# EAGLE board XMICRO-PROTO (EAGLE 6.3), part 1 of 4
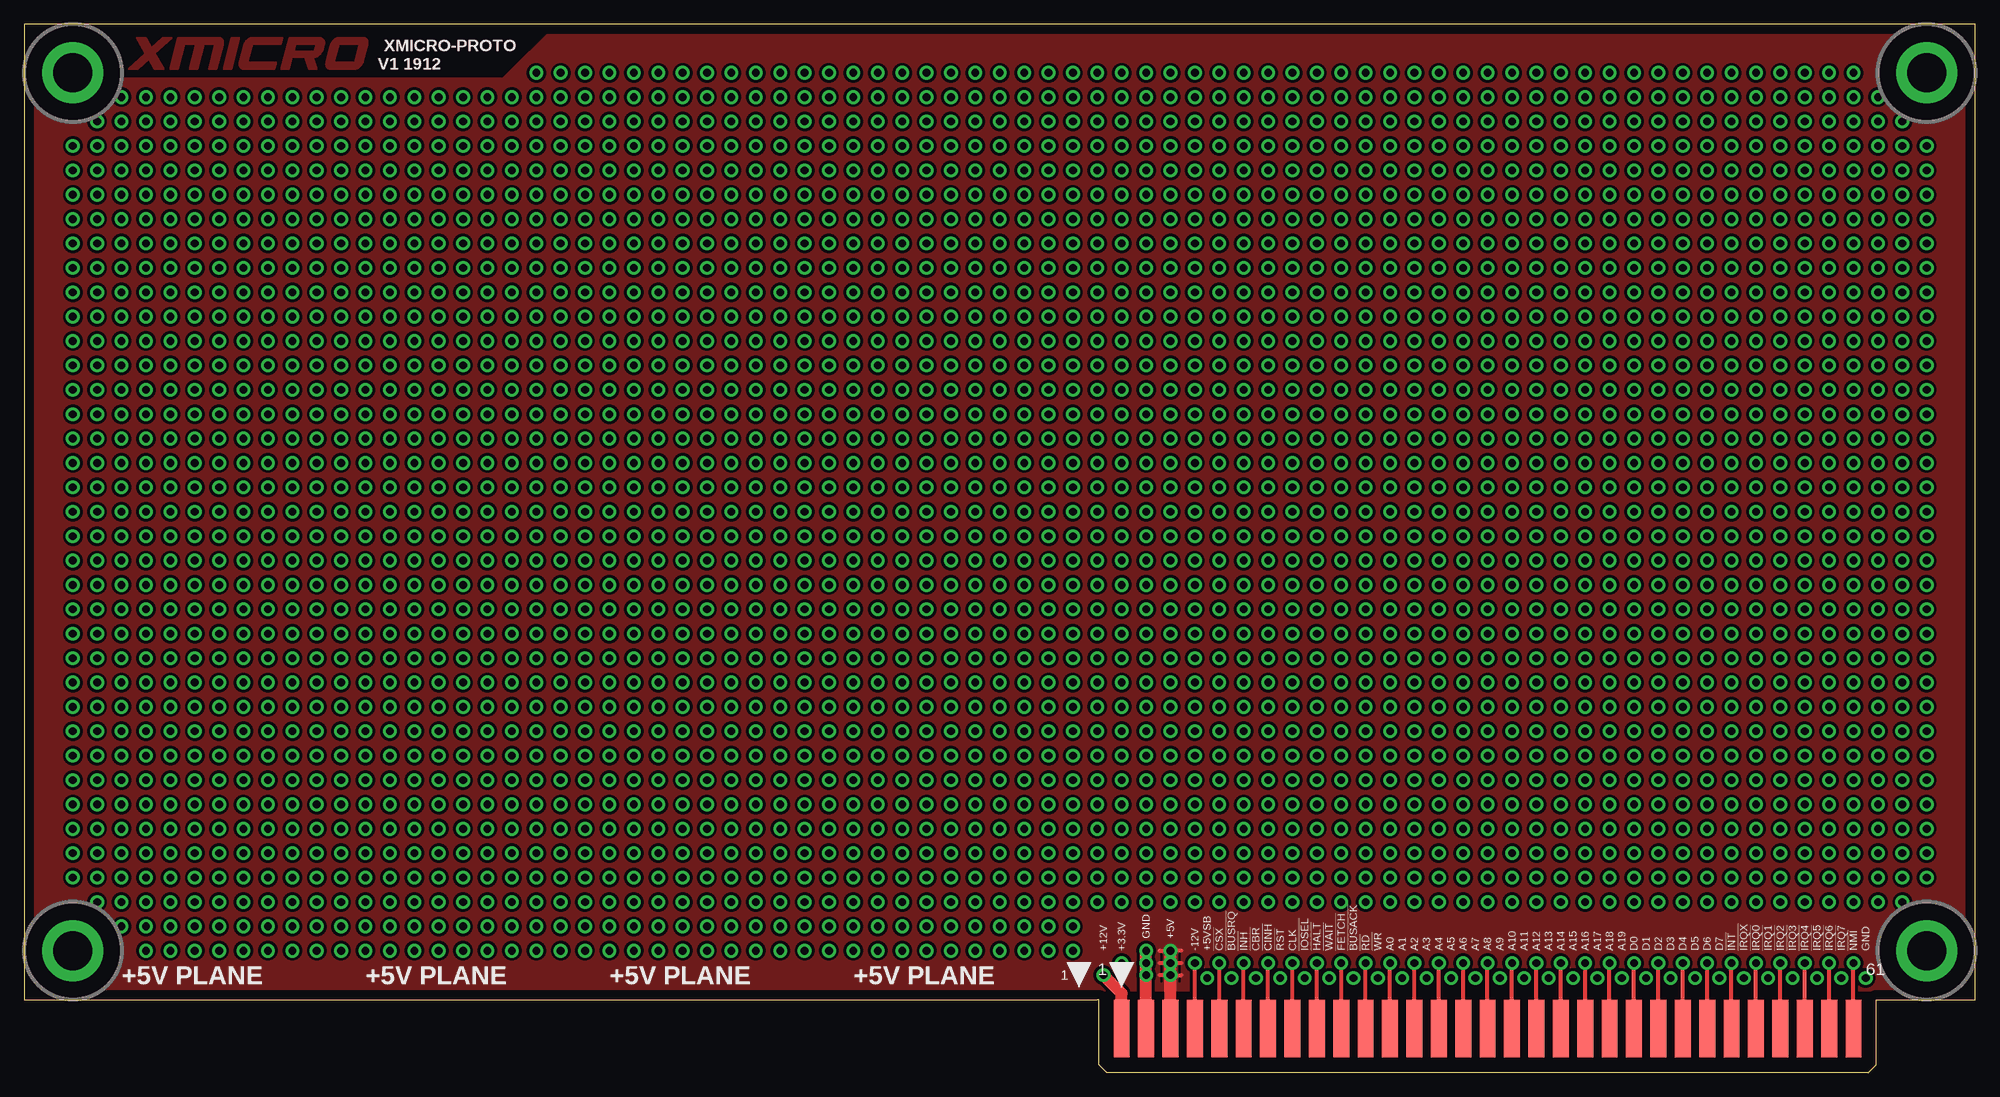
[diagram p1: board, top side]
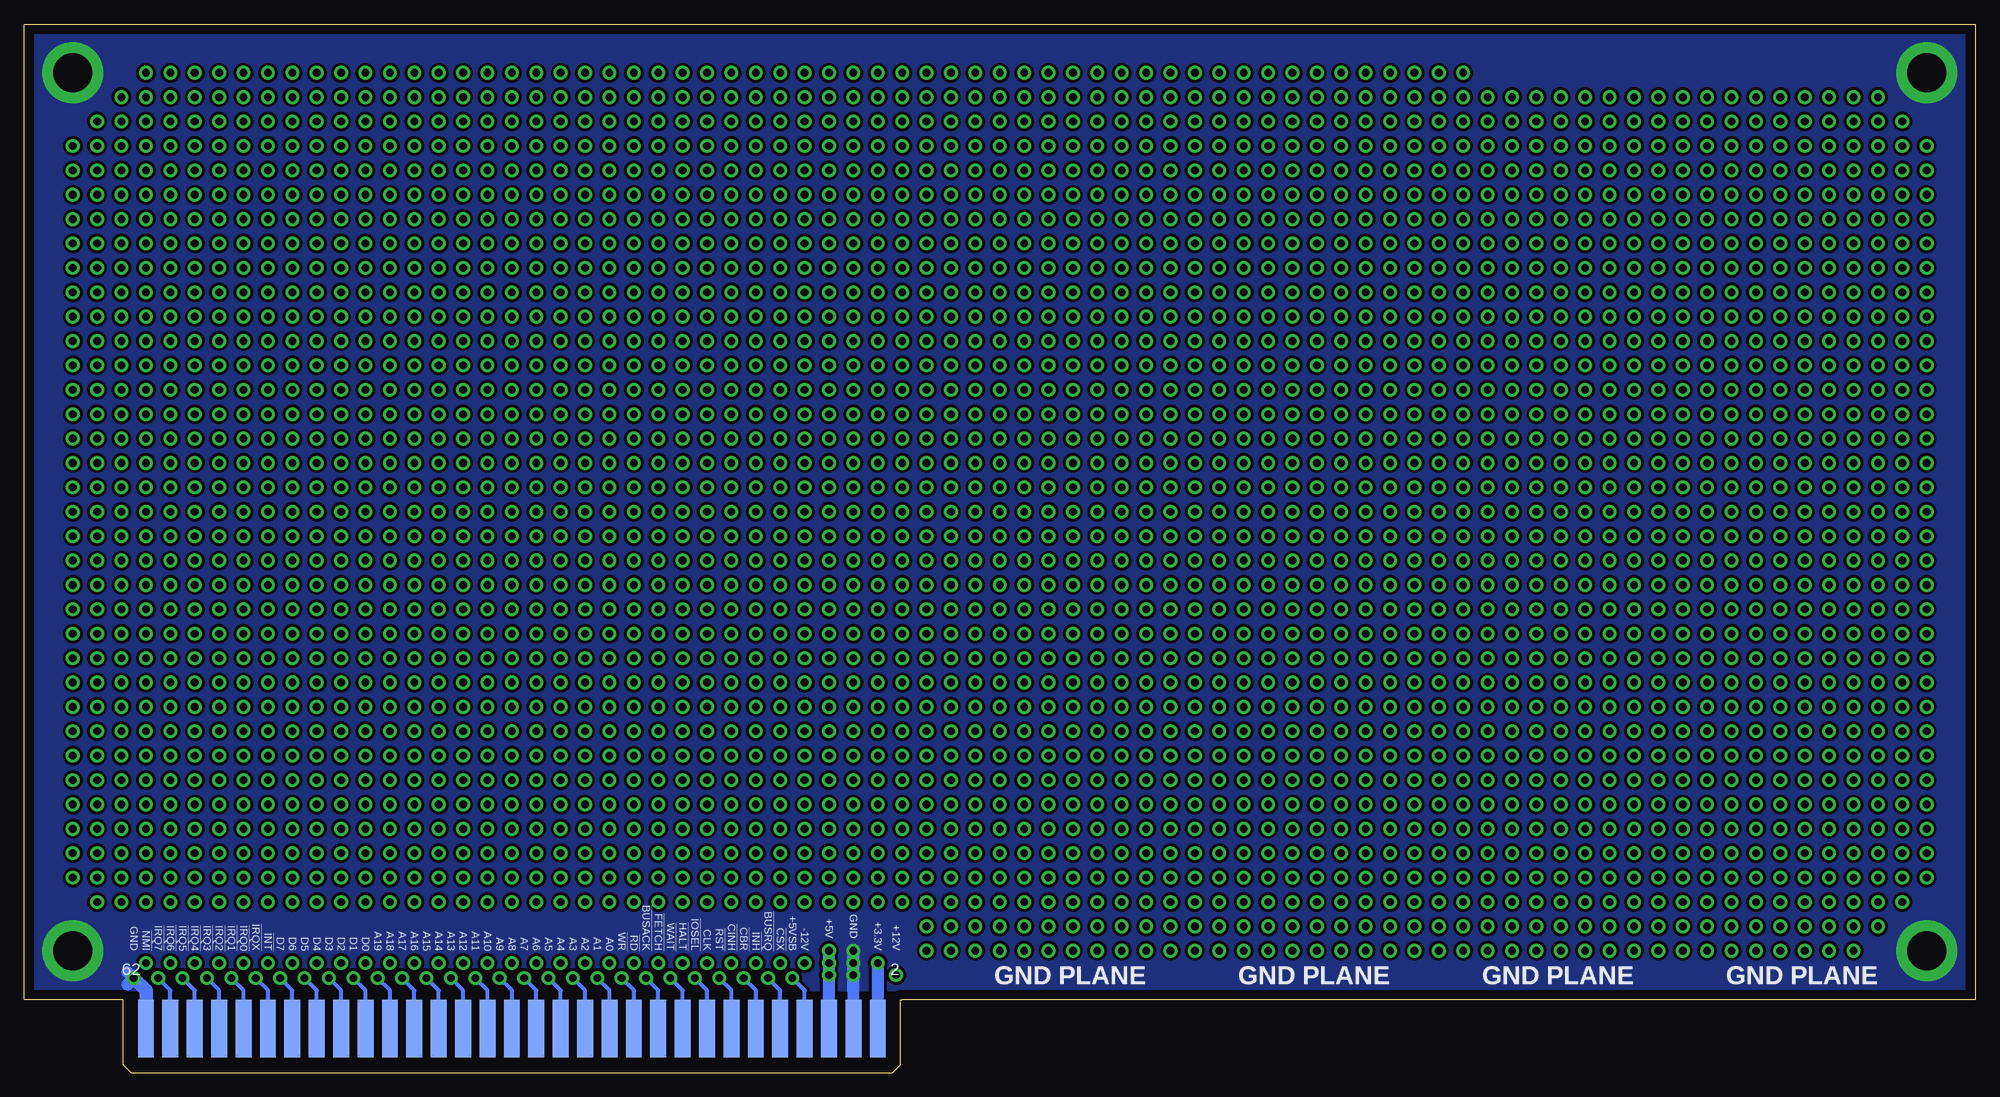
[diagram p2: board, bottom side, seen from below]

Size 203.2 x 109.22 mm. Coordinates in mm from the lower left corner, seen from the top.
Outline: 111.76,7.62 0,7.62 0,109.22 203.2,109.22 203.2,7.62 193.04,7.62
Copper layers (1*16): Top 0.035mm / dielectric 1.5mm / Bottom 0.035mm
Design rules "default *": minimum track width 10mil, minimum drill 0.3mm, track to track 12mil, track to pad 12mil, pad to pad 12mil, via to via 12mil, smd to smd 12mil, copper to edge 40mil, drill to drill 10mil, minimum pad ring 10mil, minimum via ring 8mil, stop-mask expansion 4mil, vias tented up to drill 100mil, thermal gap 12mil
Net classes: 0 default: width 0.254 mm, clearance 0.305 mm; 1 GND: width 0.254 mm, clearance 0.305 mm to class 0, clearance 0.305 mm; 2 +5V: width 0.254 mm, clearance 0.305 mm to class 0, clearance 0.381 mm to class 1, clearance 0.305 mm
tRestrict: area 0,7.6 to 10.2,17.8; area 0,99.1 to 10.2,109.2; area 193,99.1 to 203.2,109.2; area 193,7.6 to 203.2,17.8; 2 lines
bRestrict: area 188.6,8.3 to 191.1,10.8

## Footprints (pad centres in the part's own frame; a part is rotated, then mirrored left to right if it is on the bottom)
EDGE62M = smd 1.651 x 5.969: 1 -38.1,-3.01; 3 -35.56,-3.01; 5 -33.02,-3.01; 7 -30.48,-3.01; 9 -27.94,-3.01; 11 -25.4,-3.01; 13 -22.86,-3.01; 15 -20.32,-3.01; 17 -17.78,-3.01; 19 -15.24,-3.01; 21 -12.7,-3.01; 23 -10.16,-3.01; 25 -7.62,-3.01; 27 -5.08,-3.01; 29 -2.54,-3.01; 31 0,-3.01; 33 2.54,-3.01; 35 5.08,-3.01; 37 7.62,-3.01; 39 10.16,-3.01; 41 12.7,-3.01; 43 15.24,-3.01; 45 17.78,-3.01; 47 20.32,-3.01; 49 22.86,-3.01; 51 25.4,-3.01; 53 27.94,-3.01; 55 30.48,-3.01; 57 33.02,-3.01; 59 35.56,-3.01; 61 38.1,-3.01 | smd 1.651 x 5.969 bottom: 2 -38.1,-3.01; 4 -35.56,-3.01; 6 -33.02,-3.01; 8 -30.48,-3.01; 10 -27.94,-3.01; 12 -25.4,-3.01; 14 -22.86,-3.01; 16 -20.32,-3.01; 18 -17.78,-3.01; 20 -15.24,-3.01; 22 -12.7,-3.01; 24 -10.16,-3.01; 26 -7.62,-3.01; 28 -5.08,-3.01; 30 -2.54,-3.01; 32 0,-3.01; 34 2.54,-3.01; 36 5.08,-3.01; 38 7.62,-3.01; 40 10.16,-3.01; 42 12.7,-3.01; 44 15.24,-3.01; 46 17.78,-3.01; 48 20.32,-3.01; 50 22.86,-3.01; 52 25.4,-3.01; 54 27.94,-3.01; 56 30.48,-3.01; 58 33.02,-3.01; 60 35.56,-3.01; 62 38.1,-3.01

## Placement (x,y rotation side)
PC0  XMICRO-BUS-EDGE62M  [EDGE62M]  152.4,7.62 0 top

## Tracks (layer width: path | path; a pad name or v marks a point on that pad's centre or on a via)
!BUSACK  (via drill 0.8 pad 1.42)
  Bottom 0.406: PC0.20 137.16,8.57 v138.43,9.84
!BUSRQ  (via drill 0.8 pad 1.42)
  Bottom 0.406: PC0.10 124.46,8.57 v125.73,9.84
!CBR  (via drill 0.8 pad 1.42)
  Bottom 0.406: PC0.12 127,8.57 v128.27,9.84
!CINH  (via drill 0.8 pad 1.42)
  Top 0.406: PC0.13 v129.54,11.43
!CSX  (via drill 0.8 pad 1.42)
  Top 0.406: PC0.9 v124.46,11.43
!FETCH  (via drill 0.8 pad 1.42)
  Top 0.406: PC0.19 v137.16,11.43
!HALT  (via drill 0.8 pad 1.42)
  Top 0.406: PC0.17 v134.62,11.43
!INH  (via drill 0.8 pad 1.42)
  Top 0.406: PC0.11 v127,11.43
!INT  (via drill 0.8 pad 1.42)
  Top 0.406: PC0.51 v177.8,11.43
!IOSEL  (via drill 0.8 pad 1.42)
  Bottom 0.406: PC0.16 132.08,8.57 v133.35,9.84
!IRQ0  (via drill 0.8 pad 1.42)
  Top 0.406: PC0.53 v180.34,11.43
!IRQ1  (via drill 0.8 pad 1.42)
  Bottom 0.406: PC0.54 180.34,8.57 v181.61,9.84
!IRQ2  (via drill 0.8 pad 1.42)
  Top 0.406: PC0.55 v182.88,11.43
!IRQ3  (via drill 0.8 pad 1.42)
  Bottom 0.406: PC0.56 182.88,8.57 v184.15,9.84
!IRQ4  (via drill 0.8 pad 1.42)
  Top 0.406: PC0.57 v185.42,11.43
!IRQ5  (via drill 0.8 pad 1.42)
  Bottom 0.406: PC0.58 185.42,8.57 v186.69,9.84
!IRQ6  (via drill 0.8 pad 1.42)
  Top 0.406: PC0.59 v187.96,11.43
!IRQ7  (via drill 0.8 pad 1.42)
  Bottom 0.406: PC0.60 187.96,8.57 v189.23,9.84
!IRQX  (via drill 0.8 pad 1.42)
  Bottom 0.406: PC0.52 177.8,8.57 v179.07,9.84
!NMI  (via drill 0.8 pad 1.42)
  Top 0.406: PC0.61 v190.5,11.43
!RD  (via drill 0.8 pad 1.42)
  Top 0.406: PC0.21 v139.7,11.43
!RST  (via drill 0.8 pad 1.42)
  Bottom 0.406: PC0.14 129.54,8.57 v130.81,9.84
!WAIT  (via drill 0.8 pad 1.42)
  Bottom 0.406: PC0.18 134.62,8.57 v135.89,9.84
!WR  (via drill 0.8 pad 1.42)
  Bottom 0.406: PC0.22 139.7,8.57 v140.97,9.84
+3.3V  (via drill 0.8 pad 1.42)
  Bottom 1.27: PC0.2 v114.3,11.43
+5V  (via drill 0.8 pad 1.42)
  Top 0.406: 120.49,11.43 v119.38,11.43 118.27,11.43 | 118.27,12.7 v119.38,12.7 120.49,12.7 | 120.49,10.16 v119.38,10.16 118.27,10.16
  Top 1.27: PC0.6 v119.38,10.16 v119.38,11.43 v119.38,12.7
  Bottom 1.27: PC0.6 v119.38,10.16 v119.38,11.43 v119.38,12.7
  pour Top: 0,109.22 9.65,109.22 9.65,103.51 49.85,103.51 55.56,109.22 203.2,109.22 203.2,7.62 192.72,7.62 192.72,8.57 112.08,8.57 112.08,7.62 0,7.62
+5VSB  (via drill 0.8 pad 1.42)
  Bottom 0.406: PC0.8 121.92,8.57 v123.19,9.84
+12V  (via drill 0.8 pad 1.42)
  Top 1.27: PC0.1 114.3,8.26 v112.39,10.16
-12V  (via drill 0.8 pad 1.42)
  Top 0.406: PC0.7 v121.92,11.43
A0  (via drill 0.8 pad 1.42)
  Top 0.406: PC0.23 v142.24,11.43
A1  (via drill 0.8 pad 1.42)
  Bottom 0.406: PC0.24 142.24,8.57 v143.51,9.84
A2  (via drill 0.8 pad 1.42)
  Top 0.406: PC0.25 v144.78,11.43
A3  (via drill 0.8 pad 1.42)
  Bottom 0.406: PC0.26 144.78,8.57 v146.05,9.84
A4  (via drill 0.8 pad 1.42)
  Top 0.406: PC0.27 v147.32,11.43
A5  (via drill 0.8 pad 1.42)
  Bottom 0.406: PC0.28 147.32,8.57 v148.59,9.84
A6  (via drill 0.8 pad 1.42)
  Top 0.406: PC0.29 v149.86,11.43
A7  (via drill 0.8 pad 1.42)
  Bottom 0.406: PC0.30 149.86,8.57 v151.13,9.84
A8  (via drill 0.8 pad 1.42)
  Top 0.406: PC0.31 v152.4,11.43
A9  (via drill 0.8 pad 1.42)
  Bottom 0.406: PC0.32 152.4,8.57 v153.67,9.84
A10  (via drill 0.8 pad 1.42)
  Top 0.406: PC0.33 v154.94,11.43
A11  (via drill 0.8 pad 1.42)
  Bottom 0.406: PC0.34 154.94,8.57 v156.21,9.84
A12  (via drill 0.8 pad 1.42)
  Top 0.406: PC0.35 v157.48,11.43
A13  (via drill 0.8 pad 1.42)
  Bottom 0.406: PC0.36 157.48,8.57 v158.75,9.84
A14  (via drill 0.8 pad 1.42)
  Top 0.406: PC0.37 v160.02,11.43
A15  (via drill 0.8 pad 1.42)
  Bottom 0.406: PC0.38 160.02,8.57 v161.29,9.84
A16  (via drill 0.8 pad 1.42)
  Top 0.406: PC0.39 v162.56,11.43
A17  (via drill 0.8 pad 1.42)
  Bottom 0.406: PC0.40 162.56,8.57 v163.83,9.84
A18  (via drill 0.8 pad 1.42)
  Top 0.406: PC0.41 v165.1,11.43
A19  (via drill 0.8 pad 1.42)
  Bottom 0.406: PC0.42 165.1,8.57 v166.37,9.84
CLK  (via drill 0.8 pad 1.42)
  Top 0.406: PC0.15 v132.08,11.43
D0  (via drill 0.8 pad 1.42)
  Top 0.406: PC0.43 v167.64,11.43
D1  (via drill 0.8 pad 1.42)
  Bottom 0.406: PC0.44 167.64,8.57 v168.91,9.84
D2  (via drill 0.8 pad 1.42)
  Top 0.406: PC0.45 v170.18,11.43
D3  (via drill 0.8 pad 1.42)
  Bottom 0.406: PC0.46 170.18,8.57 v171.45,9.84
D4  (via drill 0.8 pad 1.42)
  Top 0.406: PC0.47 v172.72,11.43
D5  (via drill 0.8 pad 1.42)
  Bottom 0.406: PC0.48 172.72,8.57 v173.99,9.84
D6  (via drill 0.8 pad 1.42)
  Top 0.406: PC0.49 v175.26,11.43
D7  (via drill 0.8 pad 1.42)
  Bottom 0.406: PC0.50 175.26,8.57 v176.53,9.84
GND  (via drill 0.8 pad 1.42, 4.06 pad 6.35)
  Top 1.27: PC0.3 v116.84,10.16 v116.84,11.43 v116.84,12.7
  Bottom 1.27: PC0.3 v116.84,10.16 v116.84,11.43 v116.84,12.7 | 192.41,9.21 v191.77,9.84 192.41,10.48
  Bottom 1.422: PC0.62 190.5,8.57 v191.77,9.84
  other vias: 198.12,12.7 198.12,104.14 5.08,12.7 5.08,104.14
  pour Bottom: 0,109.22 203.2,109.22 203.2,7.62 192.72,7.62 192.72,8.57 112.08,8.57 112.08,7.62 0,7.62
  pour Bottom (no thermals): 0,109.22 10.16,109.22 10.16,99.06 0,99.06
  pour Bottom (no thermals): 0,17.78 10.16,17.78 10.16,7.62 0,7.62
  pour Bottom (no thermals): 193.04,17.78 203.2,17.78 203.2,7.62 193.04,7.62
  pour Bottom (no thermals): 193.04,109.22 203.2,109.22 203.2,99.06 193.04,99.06
N$1  (via drill 0.8 pad 1.42)
  other vias: 53.34,104.14
N$2  (via drill 0.8 pad 1.42)
  other vias: 55.88,104.14
N$3  (via drill 0.8 pad 1.42)
  other vias: 58.42,104.14
N$4  (via drill 0.8 pad 1.42)
  other vias: 60.96,104.14
N$5  (via drill 0.8 pad 1.42)
  other vias: 63.5,104.14
N$6  (via drill 0.8 pad 1.42)
  other vias: 66.04,104.14
N$7  (via drill 0.8 pad 1.42)
  other vias: 68.58,104.14
N$8  (via drill 0.8 pad 1.42)
  other vias: 71.12,104.14
N$9  (via drill 0.8 pad 1.42)
  other vias: 73.66,104.14
N$10  (via drill 0.8 pad 1.42)
  other vias: 76.2,104.14
N$11  (via drill 0.8 pad 1.42)
  other vias: 78.74,104.14
N$12  (via drill 0.8 pad 1.42)
  other vias: 81.28,104.14
N$13  (via drill 0.8 pad 1.42)
  other vias: 83.82,104.14
N$14  (via drill 0.8 pad 1.42)
  other vias: 86.36,104.14
N$15  (via drill 0.8 pad 1.42)
  other vias: 88.9,104.14
N$16  (via drill 0.8 pad 1.42)
  other vias: 91.44,104.14
N$17  (via drill 0.8 pad 1.42)
  other vias: 93.98,104.14
N$18  (via drill 0.8 pad 1.42)
  other vias: 96.52,104.14
N$19  (via drill 0.8 pad 1.42)
  other vias: 99.06,104.14
N$20  (via drill 0.8 pad 1.42)
  other vias: 101.6,104.14
N$21  (via drill 0.8 pad 1.42)
  other vias: 104.14,104.14
N$22  (via drill 0.8 pad 1.42)
  other vias: 106.68,104.14
N$23  (via drill 0.8 pad 1.42)
  other vias: 109.22,104.14
N$24  (via drill 0.8 pad 1.42)
  other vias: 111.76,104.14
N$25  (via drill 0.8 pad 1.42)
  other vias: 114.3,104.14
N$26  (via drill 0.8 pad 1.42)
  other vias: 116.84,104.14
N$27  (via drill 0.8 pad 1.42)
  other vias: 119.38,104.14
N$28  (via drill 0.8 pad 1.42)
  other vias: 121.92,104.14
N$29  (via drill 0.8 pad 1.42)
  other vias: 124.46,104.14
N$30  (via drill 0.8 pad 1.42)
  other vias: 127,104.14
N$31  (via drill 0.8 pad 1.42)
  other vias: 129.54,104.14
N$32  (via drill 0.8 pad 1.42)
  other vias: 132.08,104.14
N$33  (via drill 0.8 pad 1.42)
  other vias: 134.62,104.14
N$34  (via drill 0.8 pad 1.42)
  other vias: 137.16,104.14
N$35  (via drill 0.8 pad 1.42)
  other vias: 139.7,104.14
N$36  (via drill 0.8 pad 1.42)
  other vias: 142.24,104.14
N$37  (via drill 0.8 pad 1.42)
  other vias: 144.78,104.14
N$38  (via drill 0.8 pad 1.42)
  other vias: 147.32,104.14
N$39  (via drill 0.8 pad 1.42)
  other vias: 149.86,104.14
N$40  (via drill 0.8 pad 1.42)
  other vias: 152.4,104.14
N$41  (via drill 0.8 pad 1.42)
  other vias: 154.94,104.14
N$42  (via drill 0.8 pad 1.42)
  other vias: 157.48,104.14
N$43  (via drill 0.8 pad 1.42)
  other vias: 160.02,104.14
N$44  (via drill 0.8 pad 1.42)
  other vias: 162.56,104.14
N$45  (via drill 0.8 pad 1.42)
  other vias: 165.1,104.14
N$46  (via drill 0.8 pad 1.42)
  other vias: 167.64,104.14
N$47  (via drill 0.8 pad 1.42)
  other vias: 170.18,104.14
N$48  (via drill 0.8 pad 1.42)
  other vias: 172.72,104.14
N$49  (via drill 0.8 pad 1.42)
  other vias: 175.26,104.14
N$50  (via drill 0.8 pad 1.42)
  other vias: 177.8,104.14
N$51  (via drill 0.8 pad 1.42)
  other vias: 180.34,104.14
N$52  (via drill 0.8 pad 1.42)
  other vias: 182.88,104.14
N$53  (via drill 0.8 pad 1.42)
  other vias: 185.42,104.14
N$54  (via drill 0.8 pad 1.42)
  other vias: 187.96,104.14
N$55  (via drill 0.8 pad 1.42)
  other vias: 190.5,104.14
N$56  (via drill 0.8 pad 1.42)
  other vias: 10.16,101.6
N$57  (via drill 0.8 pad 1.42)
  other vias: 12.7,101.6
N$59  (via drill 0.8 pad 1.42)
  other vias: 15.24,101.6
N$60  (via drill 0.8 pad 1.42)
  other vias: 17.78,101.6
N$61  (via drill 0.8 pad 1.42)
  other vias: 20.32,101.6
N$62  (via drill 0.8 pad 1.42)
  other vias: 22.86,101.6
N$63  (via drill 0.8 pad 1.42)
  other vias: 25.4,101.6
N$64  (via drill 0.8 pad 1.42)
  other vias: 27.94,101.6
N$65  (via drill 0.8 pad 1.42)
  other vias: 30.48,101.6
N$66  (via drill 0.8 pad 1.42)
  other vias: 33.02,101.6
N$67  (via drill 0.8 pad 1.42)
  other vias: 35.56,101.6
N$68  (via drill 0.8 pad 1.42)
  other vias: 38.1,101.6
N$69  (via drill 0.8 pad 1.42)
  other vias: 40.64,101.6
N$70  (via drill 0.8 pad 1.42)
  other vias: 43.18,101.6
N$71  (via drill 0.8 pad 1.42)
  other vias: 45.72,101.6
N$72  (via drill 0.8 pad 1.42)
  other vias: 48.26,101.6
N$73  (via drill 0.8 pad 1.42)
  other vias: 50.8,101.6
N$74  (via drill 0.8 pad 1.42)
  other vias: 53.34,101.6
N$75  (via drill 0.8 pad 1.42)
  other vias: 55.88,101.6
N$76  (via drill 0.8 pad 1.42)
  other vias: 58.42,101.6
N$77  (via drill 0.8 pad 1.42)
  other vias: 60.96,101.6
N$78  (via drill 0.8 pad 1.42)
  other vias: 63.5,101.6
N$79  (via drill 0.8 pad 1.42)
  other vias: 66.04,101.6
N$80  (via drill 0.8 pad 1.42)
  other vias: 68.58,101.6
N$81  (via drill 0.8 pad 1.42)
  other vias: 71.12,101.6
N$82  (via drill 0.8 pad 1.42)
  other vias: 73.66,101.6
N$83  (via drill 0.8 pad 1.42)
  other vias: 76.2,101.6
N$84  (via drill 0.8 pad 1.42)
  other vias: 78.74,101.6
N$85  (via drill 0.8 pad 1.42)
  other vias: 81.28,101.6
N$86  (via drill 0.8 pad 1.42)
  other vias: 83.82,101.6
N$87  (via drill 0.8 pad 1.42)
  other vias: 86.36,101.6
N$88  (via drill 0.8 pad 1.42)
  other vias: 88.9,101.6
N$89  (via drill 0.8 pad 1.42)
  other vias: 91.44,101.6
N$90  (via drill 0.8 pad 1.42)
  other vias: 93.98,101.6
N$91  (via drill 0.8 pad 1.42)
  other vias: 96.52,101.6
N$92  (via drill 0.8 pad 1.42)
  other vias: 99.06,101.6
N$93  (via drill 0.8 pad 1.42)
  other vias: 101.6,101.6
N$94  (via drill 0.8 pad 1.42)
  other vias: 104.14,101.6
N$95  (via drill 0.8 pad 1.42)
  other vias: 106.68,101.6
N$96  (via drill 0.8 pad 1.42)
  other vias: 109.22,101.6
N$97  (via drill 0.8 pad 1.42)
  other vias: 111.76,101.6
N$98  (via drill 0.8 pad 1.42)
  other vias: 114.3,101.6
N$99  (via drill 0.8 pad 1.42)
  other vias: 116.84,101.6
N$100  (via drill 0.8 pad 1.42)
  other vias: 119.38,101.6
N$101  (via drill 0.8 pad 1.42)
  other vias: 121.92,101.6
N$102  (via drill 0.8 pad 1.42)
  other vias: 124.46,101.6
N$103  (via drill 0.8 pad 1.42)
  other vias: 127,101.6
N$104  (via drill 0.8 pad 1.42)
  other vias: 129.54,101.6
N$105  (via drill 0.8 pad 1.42)
  other vias: 132.08,101.6
N$106  (via drill 0.8 pad 1.42)
  other vias: 134.62,101.6
N$107  (via drill 0.8 pad 1.42)
  other vias: 137.16,101.6
N$108  (via drill 0.8 pad 1.42)
  other vias: 139.7,101.6
N$109  (via drill 0.8 pad 1.42)
  other vias: 142.24,101.6
N$110  (via drill 0.8 pad 1.42)
  other vias: 144.78,101.6
N$111  (via drill 0.8 pad 1.42)
  other vias: 147.32,101.6
N$112  (via drill 0.8 pad 1.42)
  other vias: 149.86,101.6
N$113  (via drill 0.8 pad 1.42)
  other vias: 152.4,101.6
N$114  (via drill 0.8 pad 1.42)
  other vias: 154.94,101.6
N$115  (via drill 0.8 pad 1.42)
  other vias: 157.48,101.6
N$116  (via drill 0.8 pad 1.42)
  other vias: 160.02,101.6
N$117  (via drill 0.8 pad 1.42)
  other vias: 162.56,101.6
N$118  (via drill 0.8 pad 1.42)
  other vias: 165.1,101.6
N$119  (via drill 0.8 pad 1.42)
  other vias: 167.64,101.6
N$120  (via drill 0.8 pad 1.42)
  other vias: 170.18,101.6
N$121  (via drill 0.8 pad 1.42)
  other vias: 172.72,101.6
N$122  (via drill 0.8 pad 1.42)
  other vias: 175.26,101.6
N$123  (via drill 0.8 pad 1.42)
  other vias: 177.8,101.6
N$124  (via drill 0.8 pad 1.42)
  other vias: 180.34,101.6
N$125  (via drill 0.8 pad 1.42)
  other vias: 182.88,101.6
N$126  (via drill 0.8 pad 1.42)
  other vias: 185.42,101.6
N$127  (via drill 0.8 pad 1.42)
  other vias: 187.96,101.6
N$128  (via drill 0.8 pad 1.42)
  other vias: 190.5,101.6
N$129  (via drill 0.8 pad 1.42)
  other vias: 193.04,101.6
N$130  (via drill 0.8 pad 1.42)
  other vias: 7.62,99.06
N$131  (via drill 0.8 pad 1.42)
  other vias: 10.16,99.06
N$132  (via drill 0.8 pad 1.42)
  other vias: 12.7,99.06
N$133  (via drill 0.8 pad 1.42)
  other vias: 15.24,99.06
N$134  (via drill 0.8 pad 1.42)
  other vias: 17.78,99.06
N$135  (via drill 0.8 pad 1.42)
  other vias: 20.32,99.06
N$136  (via drill 0.8 pad 1.42)
  other vias: 22.86,99.06
N$137  (via drill 0.8 pad 1.42)
  other vias: 25.4,99.06
N$138  (via drill 0.8 pad 1.42)
  other vias: 27.94,99.06
N$139  (via drill 0.8 pad 1.42)
  other vias: 30.48,99.06
N$140  (via drill 0.8 pad 1.42)
  other vias: 33.02,99.06
N$141  (via drill 0.8 pad 1.42)
  other vias: 35.56,99.06
N$142  (via drill 0.8 pad 1.42)
  other vias: 38.1,99.06
N$143  (via drill 0.8 pad 1.42)
  other vias: 40.64,99.06
N$144  (via drill 0.8 pad 1.42)
  other vias: 43.18,99.06
N$145  (via drill 0.8 pad 1.42)
  other vias: 45.72,99.06
N$146  (via drill 0.8 pad 1.42)
  other vias: 48.26,99.06
N$147  (via drill 0.8 pad 1.42)
  other vias: 50.8,99.06
N$148  (via drill 0.8 pad 1.42)
  other vias: 53.34,99.06
N$149  (via drill 0.8 pad 1.42)
  other vias: 55.88,99.06
N$150  (via drill 0.8 pad 1.42)
  other vias: 58.42,99.06
N$151  (via drill 0.8 pad 1.42)
  other vias: 60.96,99.06
N$152  (via drill 0.8 pad 1.42)
  other vias: 63.5,99.06
N$153  (via drill 0.8 pad 1.42)
  other vias: 66.04,99.06
N$154  (via drill 0.8 pad 1.42)
  other vias: 68.58,99.06
N$155  (via drill 0.8 pad 1.42)
  other vias: 71.12,99.06
N$156  (via drill 0.8 pad 1.42)
  other vias: 73.66,99.06
N$157  (via drill 0.8 pad 1.42)
  other vias: 76.2,99.06
N$158  (via drill 0.8 pad 1.42)
  other vias: 78.74,99.06
N$159  (via drill 0.8 pad 1.42)
  other vias: 81.28,99.06
N$160  (via drill 0.8 pad 1.42)
  other vias: 83.82,99.06
N$161  (via drill 0.8 pad 1.42)
  other vias: 86.36,99.06
N$162  (via drill 0.8 pad 1.42)
  other vias: 88.9,99.06
N$163  (via drill 0.8 pad 1.42)
  other vias: 91.44,99.06
N$164  (via drill 0.8 pad 1.42)
  other vias: 93.98,99.06
N$165  (via drill 0.8 pad 1.42)
  other vias: 96.52,99.06
N$166  (via drill 0.8 pad 1.42)
  other vias: 99.06,99.06
N$167  (via drill 0.8 pad 1.42)
  other vias: 101.6,99.06
N$168  (via drill 0.8 pad 1.42)
  other vias: 104.14,99.06
N$169  (via drill 0.8 pad 1.42)
  other vias: 106.68,99.06
N$170  (via drill 0.8 pad 1.42)
  other vias: 109.22,99.06
N$171  (via drill 0.8 pad 1.42)
  other vias: 111.76,99.06
N$172  (via drill 0.8 pad 1.42)
  other vias: 114.3,99.06
N$173  (via drill 0.8 pad 1.42)
  other vias: 116.84,99.06
N$174  (via drill 0.8 pad 1.42)
  other vias: 119.38,99.06
N$175  (via drill 0.8 pad 1.42)
  other vias: 121.92,99.06
N$176  (via drill 0.8 pad 1.42)
  other vias: 124.46,99.06
N$177  (via drill 0.8 pad 1.42)
  other vias: 127,99.06
N$178  (via drill 0.8 pad 1.42)
  other vias: 129.54,99.06
N$179  (via drill 0.8 pad 1.42)
  other vias: 132.08,99.06
N$180  (via drill 0.8 pad 1.42)
  other vias: 134.62,99.06
N$181  (via drill 0.8 pad 1.42)
  other vias: 137.16,99.06
N$182  (via drill 0.8 pad 1.42)
  other vias: 139.7,99.06
N$183  (via drill 0.8 pad 1.42)
  other vias: 142.24,99.06
N$184  (via drill 0.8 pad 1.42)
  other vias: 144.78,99.06
N$185  (via drill 0.8 pad 1.42)
  other vias: 147.32,99.06
N$186  (via drill 0.8 pad 1.42)
  other vias: 149.86,99.06
N$187  (via drill 0.8 pad 1.42)
  other vias: 152.4,99.06
N$188  (via drill 0.8 pad 1.42)
  other vias: 154.94,99.06
N$189  (via drill 0.8 pad 1.42)
  other vias: 157.48,99.06
N$190  (via drill 0.8 pad 1.42)
  other vias: 160.02,99.06
N$191  (via drill 0.8 pad 1.42)
  other vias: 162.56,99.06
N$192  (via drill 0.8 pad 1.42)
  other vias: 165.1,99.06
N$193  (via drill 0.8 pad 1.42)
  other vias: 167.64,99.06
N$194  (via drill 0.8 pad 1.42)
  other vias: 170.18,99.06
N$195  (via drill 0.8 pad 1.42)
  other vias: 172.72,99.06
N$196  (via drill 0.8 pad 1.42)
  other vias: 175.26,99.06
N$197  (via drill 0.8 pad 1.42)
  other vias: 177.8,99.06
N$198  (via drill 0.8 pad 1.42)
  other vias: 180.34,99.06
N$199  (via drill 0.8 pad 1.42)
  other vias: 182.88,99.06
N$200  (via drill 0.8 pad 1.42)
  other vias: 185.42,99.06
N$201  (via drill 0.8 pad 1.42)
  other vias: 187.96,99.06
N$202  (via drill 0.8 pad 1.42)
  other vias: 190.5,99.06
N$203  (via drill 0.8 pad 1.42)
  other vias: 193.04,99.06
N$204  (via drill 0.8 pad 1.42)
  other vias: 195.58,99.06
N$205  (via drill 0.8 pad 1.42)
  other vias: 5.08,96.52
N$206  (via drill 0.8 pad 1.42)
  other vias: 7.62,96.52
N$207  (via drill 0.8 pad 1.42)
  other vias: 10.16,96.52
N$208  (via drill 0.8 pad 1.42)
  other vias: 12.7,96.52
N$209  (via drill 0.8 pad 1.42)
  other vias: 15.24,96.52
N$210  (via drill 0.8 pad 1.42)
  other vias: 17.78,96.52
N$211  (via drill 0.8 pad 1.42)
  other vias: 20.32,96.52
N$212  (via drill 0.8 pad 1.42)
  other vias: 22.86,96.52
N$213  (via drill 0.8 pad 1.42)
  other vias: 25.4,96.52
N$214  (via drill 0.8 pad 1.42)
  other vias: 27.94,96.52
N$215  (via drill 0.8 pad 1.42)
  other vias: 30.48,96.52
N$216  (via drill 0.8 pad 1.42)
  other vias: 33.02,96.52
N$217  (via drill 0.8 pad 1.42)
  other vias: 35.56,96.52
N$218  (via drill 0.8 pad 1.42)
  other vias: 38.1,96.52
N$219  (via drill 0.8 pad 1.42)
  other vias: 40.64,96.52
N$220  (via drill 0.8 pad 1.42)
  other vias: 43.18,96.52
N$221  (via drill 0.8 pad 1.42)
  other vias: 45.72,96.52
N$222  (via drill 0.8 pad 1.42)
  other vias: 48.26,96.52
N$223  (via drill 0.8 pad 1.42)
  other vias: 50.8,96.52
N$224  (via drill 0.8 pad 1.42)
  other vias: 53.34,96.52
N$225  (via drill 0.8 pad 1.42)
  other vias: 55.88,96.52
N$226  (via drill 0.8 pad 1.42)
  other vias: 58.42,96.52
N$227  (via drill 0.8 pad 1.42)
  other vias: 60.96,96.52
N$228  (via drill 0.8 pad 1.42)
  other vias: 63.5,96.52
N$229  (via drill 0.8 pad 1.42)
  other vias: 66.04,96.52
N$230  (via drill 0.8 pad 1.42)
  other vias: 68.58,96.52
N$231  (via drill 0.8 pad 1.42)
  other vias: 71.12,96.52
N$232  (via drill 0.8 pad 1.42)
  other vias: 73.66,96.52
N$233  (via drill 0.8 pad 1.42)
  other vias: 76.2,96.52
N$234  (via drill 0.8 pad 1.42)
  other vias: 78.74,96.52
N$235  (via drill 0.8 pad 1.42)
  other vias: 81.28,96.52
N$236  (via drill 0.8 pad 1.42)
  other vias: 83.82,96.52
N$237  (via drill 0.8 pad 1.42)
  other vias: 86.36,96.52
N$238  (via drill 0.8 pad 1.42)
  other vias: 88.9,96.52
N$239  (via drill 0.8 pad 1.42)
  other vias: 91.44,96.52
N$240  (via drill 0.8 pad 1.42)
  other vias: 93.98,96.52
N$241  (via drill 0.8 pad 1.42)
  other vias: 96.52,96.52
N$242  (via drill 0.8 pad 1.42)
  other vias: 99.06,96.52
N$243  (via drill 0.8 pad 1.42)
  other vias: 101.6,96.52
N$244  (via drill 0.8 pad 1.42)
  other vias: 104.14,96.52
N$245  (via drill 0.8 pad 1.42)
  other vias: 106.68,96.52
N$246  (via drill 0.8 pad 1.42)
  other vias: 109.22,96.52
N$247  (via drill 0.8 pad 1.42)
  other vias: 111.76,96.52
N$248  (via drill 0.8 pad 1.42)
  other vias: 114.3,96.52
N$249  (via drill 0.8 pad 1.42)
  other vias: 116.84,96.52
N$250  (via drill 0.8 pad 1.42)
  other vias: 119.38,96.52
N$251  (via drill 0.8 pad 1.42)
  other vias: 121.92,96.52
N$252  (via drill 0.8 pad 1.42)
  other vias: 124.46,96.52
N$253  (via drill 0.8 pad 1.42)
  other vias: 127,96.52
N$254  (via drill 0.8 pad 1.42)
  other vias: 129.54,96.52
N$255  (via drill 0.8 pad 1.42)
  other vias: 132.08,96.52
N$256  (via drill 0.8 pad 1.42)
  other vias: 134.62,96.52
N$257  (via drill 0.8 pad 1.42)
  other vias: 137.16,96.52
N$258  (via drill 0.8 pad 1.42)
  other vias: 139.7,96.52
N$259  (via drill 0.8 pad 1.42)
  other vias: 142.24,96.52
N$260  (via drill 0.8 pad 1.42)
  other vias: 144.78,96.52
N$261  (via drill 0.8 pad 1.42)
  other vias: 147.32,96.52
N$262  (via drill 0.8 pad 1.42)
  other vias: 149.86,96.52
N$263  (via drill 0.8 pad 1.42)
  other vias: 152.4,96.52
N$264  (via drill 0.8 pad 1.42)
  other vias: 154.94,96.52
N$265  (via drill 0.8 pad 1.42)
  other vias: 157.48,96.52
N$266  (via drill 0.8 pad 1.42)
  other vias: 160.02,96.52
N$267  (via drill 0.8 pad 1.42)
  other vias: 162.56,96.52
N$268  (via drill 0.8 pad 1.42)
  other vias: 165.1,96.52
N$269  (via drill 0.8 pad 1.42)
  other vias: 167.64,96.52
N$270  (via drill 0.8 pad 1.42)
  other vias: 170.18,96.52
N$271  (via drill 0.8 pad 1.42)
  other vias: 172.72,96.52
N$272  (via drill 0.8 pad 1.42)
  other vias: 175.26,96.52
N$273  (via drill 0.8 pad 1.42)
  other vias: 177.8,96.52
N$274  (via drill 0.8 pad 1.42)
  other vias: 180.34,96.52
N$275  (via drill 0.8 pad 1.42)
  other vias: 182.88,96.52
N$276  (via drill 0.8 pad 1.42)
  other vias: 185.42,96.52
N$277  (via drill 0.8 pad 1.42)
  other vias: 187.96,96.52
N$278  (via drill 0.8 pad 1.42)
  other vias: 190.5,96.52
N$279  (via drill 0.8 pad 1.42)
  other vias: 193.04,96.52
N$280  (via drill 0.8 pad 1.42)
  other vias: 195.58,96.52
N$281  (via drill 0.8 pad 1.42)
  other vias: 198.12,96.52
N$282  (via drill 0.8 pad 1.42)
  other vias: 5.08,93.98
N$283  (via drill 0.8 pad 1.42)
  other vias: 7.62,93.98
N$284  (via drill 0.8 pad 1.42)
  other vias: 10.16,93.98
N$285  (via drill 0.8 pad 1.42)
  other vias: 12.7,93.98
N$286  (via drill 0.8 pad 1.42)
  other vias: 15.24,93.98
N$287  (via drill 0.8 pad 1.42)
  other vias: 17.78,93.98
N$288  (via drill 0.8 pad 1.42)
  other vias: 20.32,93.98
N$289  (via drill 0.8 pad 1.42)
  other vias: 22.86,93.98
N$290  (via drill 0.8 pad 1.42)
  other vias: 25.4,93.98
N$291  (via drill 0.8 pad 1.42)
  other vias: 27.94,93.98
N$292  (via drill 0.8 pad 1.42)
  other vias: 30.48,93.98
N$293  (via drill 0.8 pad 1.42)
  other vias: 33.02,93.98
N$294  (via drill 0.8 pad 1.42)
  other vias: 35.56,93.98
N$295  (via drill 0.8 pad 1.42)
  other vias: 38.1,93.98
N$296  (via drill 0.8 pad 1.42)
  other vias: 40.64,93.98
N$297  (via drill 0.8 pad 1.42)
  other vias: 43.18,93.98
N$298  (via drill 0.8 pad 1.42)
  other vias: 45.72,93.98
N$299  (via drill 0.8 pad 1.42)
  other vias: 48.26,93.98
N$300  (via drill 0.8 pad 1.42)
  other vias: 50.8,93.98
N$301  (via drill 0.8 pad 1.42)
  other vias: 53.34,93.98
N$302  (via drill 0.8 pad 1.42)
  other vias: 55.88,93.98
N$303  (via drill 0.8 pad 1.42)
  other vias: 58.42,93.98
N$304  (via drill 0.8 pad 1.42)
  other vias: 60.96,93.98
N$305  (via drill 0.8 pad 1.42)
  other vias: 63.5,93.98
N$306  (via drill 0.8 pad 1.42)
  other vias: 66.04,93.98
N$307  (via drill 0.8 pad 1.42)
  other vias: 68.58,93.98
N$308  (via drill 0.8 pad 1.42)
  other vias: 71.12,93.98
N$309  (via drill 0.8 pad 1.42)
  other vias: 73.66,93.98
N$310  (via drill 0.8 pad 1.42)
  other vias: 76.2,93.98
N$311  (via drill 0.8 pad 1.42)
  other vias: 78.74,93.98
N$312  (via drill 0.8 pad 1.42)
  other vias: 81.28,93.98
N$313  (via drill 0.8 pad 1.42)
  other vias: 83.82,93.98
N$314  (via drill 0.8 pad 1.42)
  other vias: 86.36,93.98
N$315  (via drill 0.8 pad 1.42)
  other vias: 88.9,93.98
N$316  (via drill 0.8 pad 1.42)
  other vias: 91.44,93.98
N$317  (via drill 0.8 pad 1.42)
  other vias: 93.98,93.98
N$318  (via drill 0.8 pad 1.42)
  other vias: 96.52,93.98
N$319  (via drill 0.8 pad 1.42)
  other vias: 99.06,93.98
N$320  (via drill 0.8 pad 1.42)
  other vias: 101.6,93.98
N$321  (via drill 0.8 pad 1.42)
  other vias: 104.14,93.98
N$322  (via drill 0.8 pad 1.42)
  other vias: 106.68,93.98
N$323  (via drill 0.8 pad 1.42)
  other vias: 109.22,93.98
N$324  (via drill 0.8 pad 1.42)
  other vias: 111.76,93.98
N$325  (via drill 0.8 pad 1.42)
  other vias: 114.3,93.98
N$326  (via drill 0.8 pad 1.42)
  other vias: 116.84,93.98
N$327  (via drill 0.8 pad 1.42)
  other vias: 119.38,93.98
N$328  (via drill 0.8 pad 1.42)
  other vias: 121.92,93.98
N$329  (via drill 0.8 pad 1.42)
  other vias: 124.46,93.98
N$330  (via drill 0.8 pad 1.42)
  other vias: 127,93.98
N$331  (via drill 0.8 pad 1.42)
  other vias: 129.54,93.98
N$332  (via drill 0.8 pad 1.42)
  other vias: 132.08,93.98
N$333  (via drill 0.8 pad 1.42)
  other vias: 134.62,93.98
N$334  (via drill 0.8 pad 1.42)
  other vias: 137.16,93.98
N$335  (via drill 0.8 pad 1.42)
  other vias: 139.7,93.98
N$336  (via drill 0.8 pad 1.42)
  other vias: 142.24,93.98
N$337  (via drill 0.8 pad 1.42)
  other vias: 144.78,93.98
N$338  (via drill 0.8 pad 1.42)
  other vias: 147.32,93.98
N$339  (via drill 0.8 pad 1.42)
  other vias: 149.86,93.98
N$340  (via drill 0.8 pad 1.42)
  other vias: 152.4,93.98
N$341  (via drill 0.8 pad 1.42)
  other vias: 154.94,93.98
N$342  (via drill 0.8 pad 1.42)
  other vias: 157.48,93.98
N$343  (via drill 0.8 pad 1.42)
  other vias: 160.02,93.98
N$344  (via drill 0.8 pad 1.42)
  other vias: 162.56,93.98
N$345  (via drill 0.8 pad 1.42)
  other vias: 165.1,93.98
N$346  (via drill 0.8 pad 1.42)
  other vias: 167.64,93.98
N$347  (via drill 0.8 pad 1.42)
  other vias: 170.18,93.98
N$348  (via drill 0.8 pad 1.42)
  other vias: 172.72,93.98
N$349  (via drill 0.8 pad 1.42)
  other vias: 175.26,93.98
N$350  (via drill 0.8 pad 1.42)
  other vias: 177.8,93.98
N$351  (via drill 0.8 pad 1.42)
  other vias: 180.34,93.98
N$352  (via drill 0.8 pad 1.42)
  other vias: 182.88,93.98
N$353  (via drill 0.8 pad 1.42)
  other vias: 185.42,93.98
N$354  (via drill 0.8 pad 1.42)
  other vias: 187.96,93.98
N$355  (via drill 0.8 pad 1.42)
  other vias: 190.5,93.98
N$356  (via drill 0.8 pad 1.42)
  other vias: 193.04,93.98
N$357  (via drill 0.8 pad 1.42)
  other vias: 195.58,93.98
N$358  (via drill 0.8 pad 1.42)
  other vias: 198.12,93.98
N$359  (via drill 0.8 pad 1.42)
  other vias: 5.08,91.44
N$360  (via drill 0.8 pad 1.42)
  other vias: 7.62,91.44
N$361  (via drill 0.8 pad 1.42)
  other vias: 10.16,91.44
N$362  (via drill 0.8 pad 1.42)
  other vias: 12.7,91.44
N$363  (via drill 0.8 pad 1.42)
  other vias: 15.24,91.44
N$364  (via drill 0.8 pad 1.42)
  other vias: 17.78,91.44
N$365  (via drill 0.8 pad 1.42)
  other vias: 20.32,91.44
N$366  (via drill 0.8 pad 1.42)
  other vias: 22.86,91.44
N$367  (via drill 0.8 pad 1.42)
  other vias: 25.4,91.44
N$368  (via drill 0.8 pad 1.42)
  other vias: 27.94,91.44
N$369  (via drill 0.8 pad 1.42)
  other vias: 30.48,91.44
N$370  (via drill 0.8 pad 1.42)
  other vias: 33.02,91.44
N$371  (via drill 0.8 pad 1.42)
  other vias: 35.56,91.44
N$372  (via drill 0.8 pad 1.42)
  other vias: 38.1,91.44
N$373  (via drill 0.8 pad 1.42)
  other vias: 40.64,91.44
N$374  (via drill 0.8 pad 1.42)
  other vias: 43.18,91.44
N$375  (via drill 0.8 pad 1.42)
  other vias: 45.72,91.44
N$376  (via drill 0.8 pad 1.42)
  other vias: 48.26,91.44
N$377  (via drill 0.8 pad 1.42)
  other vias: 50.8,91.44
N$378  (via drill 0.8 pad 1.42)
  other vias: 53.34,91.44
N$379  (via drill 0.8 pad 1.42)
  other vias: 55.88,91.44
N$380  (via drill 0.8 pad 1.42)
  other vias: 58.42,91.44
N$381  (via drill 0.8 pad 1.42)
  other vias: 60.96,91.44
N$382  (via drill 0.8 pad 1.42)
  other vias: 63.5,91.44
N$383  (via drill 0.8 pad 1.42)
  other vias: 66.04,91.44
N$384  (via drill 0.8 pad 1.42)
  other vias: 68.58,91.44
N$385  (via drill 0.8 pad 1.42)
  other vias: 71.12,91.44
N$386  (via drill 0.8 pad 1.42)
  other vias: 73.66,91.44
N$387  (via drill 0.8 pad 1.42)
  other vias: 76.2,91.44
N$388  (via drill 0.8 pad 1.42)
  other vias: 78.74,91.44
N$389  (via drill 0.8 pad 1.42)
  other vias: 81.28,91.44
N$390  (via drill 0.8 pad 1.42)
  other vias: 83.82,91.44
N$391  (via drill 0.8 pad 1.42)
  other vias: 86.36,91.44
N$392  (via drill 0.8 pad 1.42)
  other vias: 88.9,91.44
N$393  (via drill 0.8 pad 1.42)
  other vias: 91.44,91.44
N$394  (via drill 0.8 pad 1.42)
  other vias: 93.98,91.44
N$395  (via drill 0.8 pad 1.42)
  other vias: 96.52,91.44
N$396  (via drill 0.8 pad 1.42)
  other vias: 99.06,91.44
N$397  (via drill 0.8 pad 1.42)
  other vias: 101.6,91.44
N$398  (via drill 0.8 pad 1.42)
  other vias: 104.14,91.44
N$399  (via drill 0.8 pad 1.42)
  other vias: 106.68,91.44
N$400  (via drill 0.8 pad 1.42)
  other vias: 109.22,91.44
N$401  (via drill 0.8 pad 1.42)
  other vias: 111.76,91.44
N$402  (via drill 0.8 pad 1.42)
  other vias: 114.3,91.44
N$403  (via drill 0.8 pad 1.42)
  other vias: 116.84,91.44
N$404  (via drill 0.8 pad 1.42)
  other vias: 119.38,91.44
N$405  (via drill 0.8 pad 1.42)
  other vias: 121.92,91.44
N$406  (via drill 0.8 pad 1.42)
  other vias: 124.46,91.44
N$407  (via drill 0.8 pad 1.42)
  other vias: 127,91.44
N$408  (via drill 0.8 pad 1.42)
  other vias: 129.54,91.44
N$409  (via drill 0.8 pad 1.42)
  other vias: 132.08,91.44
N$410  (via drill 0.8 pad 1.42)
  other vias: 134.62,91.44
N$411  (via drill 0.8 pad 1.42)
  other vias: 137.16,91.44
N$412  (via drill 0.8 pad 1.42)
  other vias: 139.7,91.44
N$413  (via drill 0.8 pad 1.42)
  other vias: 142.24,91.44
N$414  (via drill 0.8 pad 1.42)
  other vias: 144.78,91.44
N$415  (via drill 0.8 pad 1.42)
  other vias: 147.32,91.44
N$416  (via drill 0.8 pad 1.42)
  other vias: 149.86,91.44
N$417  (via drill 0.8 pad 1.42)
  other vias: 152.4,91.44
N$418  (via drill 0.8 pad 1.42)
  other vias: 154.94,91.44
N$419  (via drill 0.8 pad 1.42)
  other vias: 157.48,91.44
N$420  (via drill 0.8 pad 1.42)
  other vias: 160.02,91.44
N$421  (via drill 0.8 pad 1.42)
  other vias: 162.56,91.44
N$422  (via drill 0.8 pad 1.42)
  other vias: 165.1,91.44
N$423  (via drill 0.8 pad 1.42)
  other vias: 167.64,91.44
N$424  (via drill 0.8 pad 1.42)
  other vias: 170.18,91.44
N$425  (via drill 0.8 pad 1.42)
  other vias: 172.72,91.44
N$426  (via drill 0.8 pad 1.42)
  other vias: 175.26,91.44
N$427  (via drill 0.8 pad 1.42)
  other vias: 177.8,91.44
N$428  (via drill 0.8 pad 1.42)
  other vias: 180.34,91.44
N$429  (via drill 0.8 pad 1.42)
  other vias: 182.88,91.44
N$430  (via drill 0.8 pad 1.42)
  other vias: 185.42,91.44
N$431  (via drill 0.8 pad 1.42)
  other vias: 187.96,91.44
N$432  (via drill 0.8 pad 1.42)
  other vias: 190.5,91.44
N$433  (via drill 0.8 pad 1.42)
  other vias: 193.04,91.44
N$434  (via drill 0.8 pad 1.42)
  other vias: 195.58,91.44
N$435  (via drill 0.8 pad 1.42)
  other vias: 198.12,91.44
N$436  (via drill 0.8 pad 1.42)
  other vias: 5.08,88.9
N$437  (via drill 0.8 pad 1.42)
  other vias: 7.62,88.9
N$438  (via drill 0.8 pad 1.42)
  other vias: 10.16,88.9
N$439  (via drill 0.8 pad 1.42)
  other vias: 12.7,88.9
N$440  (via drill 0.8 pad 1.42)
  other vias: 15.24,88.9
N$441  (via drill 0.8 pad 1.42)
  other vias: 17.78,88.9
N$442  (via drill 0.8 pad 1.42)
  other vias: 20.32,88.9
N$443  (via drill 0.8 pad 1.42)
  other vias: 22.86,88.9
N$444  (via drill 0.8 pad 1.42)
  other vias: 25.4,88.9
N$445  (via drill 0.8 pad 1.42)
  other vias: 27.94,88.9
N$446  (via drill 0.8 pad 1.42)
  other vias: 30.48,88.9
N$447  (via drill 0.8 pad 1.42)
  other vias: 33.02,88.9
N$448  (via drill 0.8 pad 1.42)
  other vias: 35.56,88.9
N$449  (via drill 0.8 pad 1.42)
  other vias: 38.1,88.9
N$450  (via drill 0.8 pad 1.42)
  other vias: 40.64,88.9
N$451  (via drill 0.8 pad 1.42)
  other vias: 43.18,88.9
N$452  (via drill 0.8 pad 1.42)
  other vias: 45.72,88.9
N$453  (via drill 0.8 pad 1.42)
  other vias: 48.26,88.9
N$454  (via drill 0.8 pad 1.42)
  other vias: 50.8,88.9
N$455  (via drill 0.8 pad 1.42)
  other vias: 53.34,88.9
N$456  (via drill 0.8 pad 1.42)
  other vias: 55.88,88.9
N$457  (via drill 0.8 pad 1.42)
  other vias: 58.42,88.9
N$458  (via drill 0.8 pad 1.42)
  other vias: 60.96,88.9
N$459  (via drill 0.8 pad 1.42)
  other vias: 63.5,88.9
N$460  (via drill 0.8 pad 1.42)
  other vias: 66.04,88.9
N$461  (via drill 0.8 pad 1.42)
  other vias: 68.58,88.9
N$462  (via drill 0.8 pad 1.42)
  other vias: 71.12,88.9
N$463  (via drill 0.8 pad 1.42)
  other vias: 73.66,88.9
N$464  (via drill 0.8 pad 1.42)
  other vias: 76.2,88.9
N$465  (via drill 0.8 pad 1.42)
  other vias: 78.74,88.9
N$466  (via drill 0.8 pad 1.42)
  other vias: 81.28,88.9
N$467  (via drill 0.8 pad 1.42)
  other vias: 83.82,88.9
N$468  (via drill 0.8 pad 1.42)
  other vias: 86.36,88.9
N$469  (via drill 0.8 pad 1.42)
  other vias: 88.9,88.9
N$470  (via drill 0.8 pad 1.42)
  other vias: 91.44,88.9
N$471  (via drill 0.8 pad 1.42)
  other vias: 93.98,88.9
N$472  (via drill 0.8 pad 1.42)
  other vias: 96.52,88.9
N$473  (via drill 0.8 pad 1.42)
  other vias: 99.06,88.9
N$474  (via drill 0.8 pad 1.42)
  other vias: 101.6,88.9
N$475  (via drill 0.8 pad 1.42)
  other vias: 104.14,88.9
N$476  (via drill 0.8 pad 1.42)
  other vias: 106.68,88.9
N$477  (via drill 0.8 pad 1.42)
  other vias: 109.22,88.9
N$478  (via drill 0.8 pad 1.42)
  other vias: 111.76,88.9
N$479  (via drill 0.8 pad 1.42)
  other vias: 114.3,88.9
N$480  (via drill 0.8 pad 1.42)
  other vias: 116.84,88.9
N$481  (via drill 0.8 pad 1.42)
  other vias: 119.38,88.9
N$482  (via drill 0.8 pad 1.42)
  other vias: 121.92,88.9
N$483  (via drill 0.8 pad 1.42)
  other vias: 124.46,88.9
N$484  (via drill 0.8 pad 1.42)
  other vias: 127,88.9
N$485  (via drill 0.8 pad 1.42)
  other vias: 129.54,88.9
N$486  (via drill 0.8 pad 1.42)
  other vias: 132.08,88.9
N$487  (via drill 0.8 pad 1.42)
  other vias: 134.62,88.9
N$488  (via drill 0.8 pad 1.42)
  other vias: 137.16,88.9
N$489  (via drill 0.8 pad 1.42)
  other vias: 139.7,88.9
N$490  (via drill 0.8 pad 1.42)
  other vias: 142.24,88.9
N$491  (via drill 0.8 pad 1.42)
  other vias: 144.78,88.9
N$492  (via drill 0.8 pad 1.42)
  other vias: 147.32,88.9
N$493  (via drill 0.8 pad 1.42)
  other vias: 149.86,88.9
N$494  (via drill 0.8 pad 1.42)
  other vias: 152.4,88.9
N$495  (via drill 0.8 pad 1.42)
  other vias: 154.94,88.9
N$496  (via drill 0.8 pad 1.42)
  other vias: 157.48,88.9
N$497  (via drill 0.8 pad 1.42)
  other vias: 160.02,88.9
N$498  (via drill 0.8 pad 1.42)
  other vias: 162.56,88.9
N$499  (via drill 0.8 pad 1.42)
  other vias: 165.1,88.9
N$500  (via drill 0.8 pad 1.42)
  other vias: 167.64,88.9
N$501  (via drill 0.8 pad 1.42)
  other vias: 170.18,88.9
N$502  (via drill 0.8 pad 1.42)
  other vias: 172.72,88.9
N$503  (via drill 0.8 pad 1.42)
  other vias: 175.26,88.9
N$504  (via drill 0.8 pad 1.42)
  other vias: 177.8,88.9
N$505  (via drill 0.8 pad 1.42)
  other vias: 180.34,88.9
N$506  (via drill 0.8 pad 1.42)
  other vias: 182.88,88.9
N$507  (via drill 0.8 pad 1.42)
  other vias: 185.42,88.9
N$508  (via drill 0.8 pad 1.42)
  other vias: 187.96,88.9
N$509  (via drill 0.8 pad 1.42)
  other vias: 190.5,88.9
N$510  (via drill 0.8 pad 1.42)
  other vias: 193.04,88.9
N$511  (via drill 0.8 pad 1.42)
  other vias: 195.58,88.9
N$512  (via drill 0.8 pad 1.42)
  other vias: 198.12,88.9
N$513  (via drill 0.8 pad 1.42)
  other vias: 5.08,86.36
N$514  (via drill 0.8 pad 1.42)
  other vias: 7.62,86.36
N$515  (via drill 0.8 pad 1.42)
  other vias: 10.16,86.36
N$516  (via drill 0.8 pad 1.42)
  other vias: 12.7,86.36
N$517  (via drill 0.8 pad 1.42)
  other vias: 15.24,86.36
N$518  (via drill 0.8 pad 1.42)
  other vias: 17.78,86.36
N$519  (via drill 0.8 pad 1.42)
  other vias: 20.32,86.36
N$520  (via drill 0.8 pad 1.42)
  other vias: 22.86,86.36
N$521  (via drill 0.8 pad 1.42)
  other vias: 25.4,86.36
N$522  (via drill 0.8 pad 1.42)
  other vias: 27.94,86.36
N$523  (via drill 0.8 pad 1.42)
  other vias: 30.48,86.36
N$524  (via drill 0.8 pad 1.42)
  other vias: 33.02,86.36
N$525  (via drill 0.8 pad 1.42)
  other vias: 35.56,86.36
N$526  (via drill 0.8 pad 1.42)
  other vias: 38.1,86.36
N$527  (via drill 0.8 pad 1.42)
  other vias: 40.64,86.36
N$528  (via drill 0.8 pad 1.42)
  other vias: 43.18,86.36
N$529  (via drill 0.8 pad 1.42)
  other vias: 45.72,86.36
N$530  (via drill 0.8 pad 1.42)
  other vias: 48.26,86.36
N$531  (via drill 0.8 pad 1.42)
  other vias: 50.8,86.36
N$532  (via drill 0.8 pad 1.42)
  other vias: 53.34,86.36
N$533  (via drill 0.8 pad 1.42)
  other vias: 55.88,86.36
N$534  (via drill 0.8 pad 1.42)
  other vias: 58.42,86.36
N$535  (via drill 0.8 pad 1.42)
  other vias: 60.96,86.36
N$536  (via drill 0.8 pad 1.42)
  other vias: 63.5,86.36
N$537  (via drill 0.8 pad 1.42)
  other vias: 66.04,86.36
N$538  (via drill 0.8 pad 1.42)
  other vias: 68.58,86.36
N$539  (via drill 0.8 pad 1.42)
  other vias: 71.12,86.36
N$540  (via drill 0.8 pad 1.42)
  other vias: 73.66,86.36
N$541  (via drill 0.8 pad 1.42)
  other vias: 76.2,86.36
N$542  (via drill 0.8 pad 1.42)
  other vias: 78.74,86.36
N$543  (via drill 0.8 pad 1.42)
  other vias: 81.28,86.36
N$544  (via drill 0.8 pad 1.42)
  other vias: 83.82,86.36
N$545  (via drill 0.8 pad 1.42)
  other vias: 86.36,86.36
N$546  (via drill 0.8 pad 1.42)
  other vias: 88.9,86.36
N$547  (via drill 0.8 pad 1.42)
  other vias: 91.44,86.36
N$548  (via drill 0.8 pad 1.42)
  other vias: 93.98,86.36
N$549  (via drill 0.8 pad 1.42)
  other vias: 96.52,86.36
N$550  (via drill 0.8 pad 1.42)
  other vias: 99.06,86.36
N$551  (via drill 0.8 pad 1.42)
  other vias: 101.6,86.36
N$552  (via drill 0.8 pad 1.42)
  other vias: 104.14,86.36
N$553  (via drill 0.8 pad 1.42)
  other vias: 106.68,86.36
N$554  (via drill 0.8 pad 1.42)
  other vias: 109.22,86.36
N$555  (via drill 0.8 pad 1.42)
  other vias: 111.76,86.36
N$556  (via drill 0.8 pad 1.42)
  other vias: 114.3,86.36
N$557  (via drill 0.8 pad 1.42)
  other vias: 116.84,86.36
N$558  (via drill 0.8 pad 1.42)
  other vias: 119.38,86.36
N$559  (via drill 0.8 pad 1.42)
  other vias: 121.92,86.36
N$560  (via drill 0.8 pad 1.42)
  other vias: 124.46,86.36
N$561  (via drill 0.8 pad 1.42)
  other vias: 127,86.36
N$562  (via drill 0.8 pad 1.42)
  other vias: 129.54,86.36
N$563  (via drill 0.8 pad 1.42)
  other vias: 132.08,86.36
N$564  (via drill 0.8 pad 1.42)
  other vias: 134.62,86.36
N$565  (via drill 0.8 pad 1.42)
  other vias: 137.16,86.36
N$566  (via drill 0.8 pad 1.42)
  other vias: 139.7,86.36
N$567  (via drill 0.8 pad 1.42)
  other vias: 142.24,86.36
N$568  (via drill 0.8 pad 1.42)
  other vias: 144.78,86.36
N$569  (via drill 0.8 pad 1.42)
  other vias: 147.32,86.36
N$570  (via drill 0.8 pad 1.42)
  other vias: 149.86,86.36
N$571  (via drill 0.8 pad 1.42)
  other vias: 152.4,86.36
N$572  (via drill 0.8 pad 1.42)
  other vias: 154.94,86.36
N$573  (via drill 0.8 pad 1.42)
  other vias: 157.48,86.36
N$574  (via drill 0.8 pad 1.42)
  other vias: 160.02,86.36
N$575  (via drill 0.8 pad 1.42)
  other vias: 162.56,86.36
N$576  (via drill 0.8 pad 1.42)
  other vias: 165.1,86.36
N$577  (via drill 0.8 pad 1.42)
  other vias: 167.64,86.36
N$578  (via drill 0.8 pad 1.42)
  other vias: 170.18,86.36
N$579  (via drill 0.8 pad 1.42)
  other vias: 172.72,86.36
N$580  (via drill 0.8 pad 1.42)
  other vias: 175.26,86.36
N$581  (via drill 0.8 pad 1.42)
  other vias: 177.8,86.36
N$582  (via drill 0.8 pad 1.42)
  other vias: 180.34,86.36
N$583  (via drill 0.8 pad 1.42)
  other vias: 182.88,86.36
N$584  (via drill 0.8 pad 1.42)
  other vias: 185.42,86.36
N$585  (via drill 0.8 pad 1.42)
  other vias: 187.96,86.36
N$586  (via drill 0.8 pad 1.42)
  other vias: 190.5,86.36
N$587  (via drill 0.8 pad 1.42)
  other vias: 193.04,86.36
N$588  (via drill 0.8 pad 1.42)
  other vias: 195.58,86.36
N$589  (via drill 0.8 pad 1.42)
  other vias: 198.12,86.36
N$590  (via drill 0.8 pad 1.42)
  other vias: 5.08,83.82
N$591  (via drill 0.8 pad 1.42)
  other vias: 7.62,83.82
N$592  (via drill 0.8 pad 1.42)
  other vias: 10.16,83.82
N$593  (via drill 0.8 pad 1.42)
  other vias: 12.7,83.82
N$594  (via drill 0.8 pad 1.42)
  other vias: 15.24,83.82
N$595  (via drill 0.8 pad 1.42)
  other vias: 17.78,83.82
N$596  (via drill 0.8 pad 1.42)
  other vias: 20.32,83.82
N$597  (via drill 0.8 pad 1.42)
  other vias: 22.86,83.82
N$598  (via drill 0.8 pad 1.42)
  other vias: 25.4,83.82
N$599  (via drill 0.8 pad 1.42)
  other vias: 27.94,83.82
N$600  (via drill 0.8 pad 1.42)
  other vias: 30.48,83.82
N$601  (via drill 0.8 pad 1.42)
  other vias: 33.02,83.82
N$602  (via drill 0.8 pad 1.42)
  other vias: 35.56,83.82
N$603  (via drill 0.8 pad 1.42)
  other vias: 38.1,83.82
N$604  (via drill 0.8 pad 1.42)
  other vias: 40.64,83.82
N$605  (via drill 0.8 pad 1.42)
  other vias: 43.18,83.82
N$606  (via drill 0.8 pad 1.42)
  other vias: 45.72,83.82
N$607  (via drill 0.8 pad 1.42)
  other vias: 48.26,83.82
N$608  (via drill 0.8 pad 1.42)
  other vias: 50.8,83.82
N$609  (via drill 0.8 pad 1.42)
  other vias: 53.34,83.82
N$610  (via drill 0.8 pad 1.42)
  other vias: 55.88,83.82
N$611  (via drill 0.8 pad 1.42)
  other vias: 58.42,83.82
N$612  (via drill 0.8 pad 1.42)
  other vias: 60.96,83.82
N$613  (via drill 0.8 pad 1.42)
  other vias: 63.5,83.82
N$614  (via drill 0.8 pad 1.42)
  other vias: 66.04,83.82
N$615  (via drill 0.8 pad 1.42)
  other vias: 68.58,83.82
N$616  (via drill 0.8 pad 1.42)
  other vias: 71.12,83.82
N$617  (via drill 0.8 pad 1.42)
  other vias: 73.66,83.82
N$618  (via drill 0.8 pad 1.42)
  other vias: 76.2,83.82
N$619  (via drill 0.8 pad 1.42)
  other vias: 78.74,83.82
N$620  (via drill 0.8 pad 1.42)
  other vias: 81.28,83.82
N$621  (via drill 0.8 pad 1.42)
  other vias: 83.82,83.82
N$622  (via drill 0.8 pad 1.42)
  other vias: 86.36,83.82
N$623  (via drill 0.8 pad 1.42)
  other vias: 88.9,83.82
N$624  (via drill 0.8 pad 1.42)
  other vias: 91.44,83.82
N$625  (via drill 0.8 pad 1.42)
  other vias: 93.98,83.82
N$626  (via drill 0.8 pad 1.42)
  other vias: 96.52,83.82
N$627  (via drill 0.8 pad 1.42)
  other vias: 99.06,83.82
N$628  (via drill 0.8 pad 1.42)
  other vias: 101.6,83.82
N$629  (via drill 0.8 pad 1.42)
  other vias: 104.14,83.82
N$630  (via drill 0.8 pad 1.42)
  other vias: 106.68,83.82
N$631  (via drill 0.8 pad 1.42)
  other vias: 109.22,83.82
N$632  (via drill 0.8 pad 1.42)
  other vias: 111.76,83.82
N$633  (via drill 0.8 pad 1.42)
  other vias: 114.3,83.82
N$634  (via drill 0.8 pad 1.42)
  other vias: 116.84,83.82
N$635  (via drill 0.8 pad 1.42)
  other vias: 119.38,83.82
N$636  (via drill 0.8 pad 1.42)
  other vias: 121.92,83.82
N$637  (via drill 0.8 pad 1.42)
  other vias: 124.46,83.82
N$638  (via drill 0.8 pad 1.42)
  other vias: 127,83.82
N$639  (via drill 0.8 pad 1.42)
  other vias: 129.54,83.82
N$640  (via drill 0.8 pad 1.42)
  other vias: 132.08,83.82
N$641  (via drill 0.8 pad 1.42)
  other vias: 134.62,83.82
N$642  (via drill 0.8 pad 1.42)
  other vias: 137.16,83.82
N$643  (via drill 0.8 pad 1.42)
  other vias: 139.7,83.82
N$644  (via drill 0.8 pad 1.42)
  other vias: 142.24,83.82
N$645  (via drill 0.8 pad 1.42)
  other vias: 144.78,83.82
N$646  (via drill 0.8 pad 1.42)
  other vias: 147.32,83.82
N$647  (via drill 0.8 pad 1.42)
  other vias: 149.86,83.82
N$648  (via drill 0.8 pad 1.42)
  other vias: 152.4,83.82
N$649  (via drill 0.8 pad 1.42)
  other vias: 154.94,83.82
N$650  (via drill 0.8 pad 1.42)
  other vias: 157.48,83.82
N$651  (via drill 0.8 pad 1.42)
  other vias: 160.02,83.82
N$652  (via drill 0.8 pad 1.42)
  other vias: 162.56,83.82
N$653  (via drill 0.8 pad 1.42)
  other vias: 165.1,83.82
N$654  (via drill 0.8 pad 1.42)
  other vias: 167.64,83.82
N$655  (via drill 0.8 pad 1.42)
  other vias: 170.18,83.82
N$656  (via drill 0.8 pad 1.42)
  other vias: 172.72,83.82
N$657  (via drill 0.8 pad 1.42)
  other vias: 175.26,83.82
N$658  (via drill 0.8 pad 1.42)
  other vias: 177.8,83.82
N$659  (via drill 0.8 pad 1.42)
  other vias: 180.34,83.82
N$660  (via drill 0.8 pad 1.42)
  other vias: 182.88,83.82
N$661  (via drill 0.8 pad 1.42)
  other vias: 185.42,83.82
N$662  (via drill 0.8 pad 1.42)
  other vias: 187.96,83.82
N$663  (via drill 0.8 pad 1.42)
  other vias: 190.5,83.82
N$664  (via drill 0.8 pad 1.42)
  other vias: 193.04,83.82
N$665  (via drill 0.8 pad 1.42)
  other vias: 195.58,83.82
N$666  (via drill 0.8 pad 1.42)
  other vias: 198.12,83.82
N$667  (via drill 0.8 pad 1.42)
  other vias: 5.08,81.28
N$668  (via drill 0.8 pad 1.42)
  other vias: 7.62,81.28
N$669  (via drill 0.8 pad 1.42)
  other vias: 10.16,81.28
N$670  (via drill 0.8 pad 1.42)
  other vias: 12.7,81.28
N$671  (via drill 0.8 pad 1.42)
  other vias: 15.24,81.28
N$672  (via drill 0.8 pad 1.42)
  other vias: 17.78,81.28
N$673  (via drill 0.8 pad 1.42)
  other vias: 20.32,81.28
N$674  (via drill 0.8 pad 1.42)
  other vias: 22.86,81.28
N$675  (via drill 0.8 pad 1.42)
  other vias: 25.4,81.28
N$676  (via drill 0.8 pad 1.42)
  other vias: 27.94,81.28
N$677  (via drill 0.8 pad 1.42)
  other vias: 30.48,81.28
N$678  (via drill 0.8 pad 1.42)
  other vias: 33.02,81.28
N$679  (via drill 0.8 pad 1.42)
  other vias: 35.56,81.28
N$680  (via drill 0.8 pad 1.42)
  other vias: 38.1,81.28
N$681  (via drill 0.8 pad 1.42)
  other vias: 40.64,81.28
N$682  (via drill 0.8 pad 1.42)
  other vias: 43.18,81.28
N$683  (via drill 0.8 pad 1.42)
  other vias: 45.72,81.28
N$684  (via drill 0.8 pad 1.42)
  other vias: 48.26,81.28
N$685  (via drill 0.8 pad 1.42)
  other vias: 50.8,81.28
N$686  (via drill 0.8 pad 1.42)
  other vias: 53.34,81.28
N$687  (via drill 0.8 pad 1.42)
  other vias: 55.88,81.28
N$688  (via drill 0.8 pad 1.42)
  other vias: 58.42,81.28
N$689  (via drill 0.8 pad 1.42)
  other vias: 60.96,81.28
N$690  (via drill 0.8 pad 1.42)
  other vias: 63.5,81.28
N$691  (via drill 0.8 pad 1.42)
  other vias: 66.04,81.28
N$692  (via drill 0.8 pad 1.42)
  other vias: 68.58,81.28
N$693  (via drill 0.8 pad 1.42)
  other vias: 71.12,81.28
N$694  (via drill 0.8 pad 1.42)
  other vias: 73.66,81.28
N$695  (via drill 0.8 pad 1.42)
  other vias: 76.2,81.28
N$696  (via drill 0.8 pad 1.42)
  other vias: 78.74,81.28
N$697  (via drill 0.8 pad 1.42)
  other vias: 81.28,81.28
N$698  (via drill 0.8 pad 1.42)
  other vias: 83.82,81.28
N$699  (via drill 0.8 pad 1.42)
  other vias: 86.36,81.28
N$700  (via drill 0.8 pad 1.42)
  other vias: 88.9,81.28
N$701  (via drill 0.8 pad 1.42)
  other vias: 91.44,81.28
N$702  (via drill 0.8 pad 1.42)
  other vias: 93.98,81.28
N$703  (via drill 0.8 pad 1.42)
  other vias: 96.52,81.28
N$704  (via drill 0.8 pad 1.42)
  other vias: 99.06,81.28
N$705  (via drill 0.8 pad 1.42)
  other vias: 101.6,81.28
N$706  (via drill 0.8 pad 1.42)
  other vias: 104.14,81.28
N$707  (via drill 0.8 pad 1.42)
  other vias: 106.68,81.28
N$708  (via drill 0.8 pad 1.42)
  other vias: 109.22,81.28
N$709  (via drill 0.8 pad 1.42)
  other vias: 111.76,81.28
N$710  (via drill 0.8 pad 1.42)
  other vias: 114.3,81.28
N$711  (via drill 0.8 pad 1.42)
  other vias: 116.84,81.28
N$712  (via drill 0.8 pad 1.42)
  other vias: 119.38,81.28
N$713  (via drill 0.8 pad 1.42)
  other vias: 121.92,81.28
N$714  (via drill 0.8 pad 1.42)
  other vias: 124.46,81.28
N$715  (via drill 0.8 pad 1.42)
  other vias: 127,81.28
N$716  (via drill 0.8 pad 1.42)
  other vias: 129.54,81.28
N$717  (via drill 0.8 pad 1.42)
  other vias: 132.08,81.28
N$718  (via drill 0.8 pad 1.42)
  other vias: 134.62,81.28
N$719  (via drill 0.8 pad 1.42)
  other vias: 137.16,81.28
N$720  (via drill 0.8 pad 1.42)
  other vias: 139.7,81.28
N$721  (via drill 0.8 pad 1.42)
  other vias: 142.24,81.28
N$722  (via drill 0.8 pad 1.42)
  other vias: 144.78,81.28
N$723  (via drill 0.8 pad 1.42)
  other vias: 147.32,81.28
N$724  (via drill 0.8 pad 1.42)
  other vias: 149.86,81.28
N$725  (via drill 0.8 pad 1.42)
  other vias: 152.4,81.28
N$726  (via drill 0.8 pad 1.42)